# Altium schematic sheet 1_INDEX.SchDoc
size 420 x 297 mm; SheetNumber: 1; SheetTotal: 7; Project: SATELLITE-4U-LASER-INT-EXT
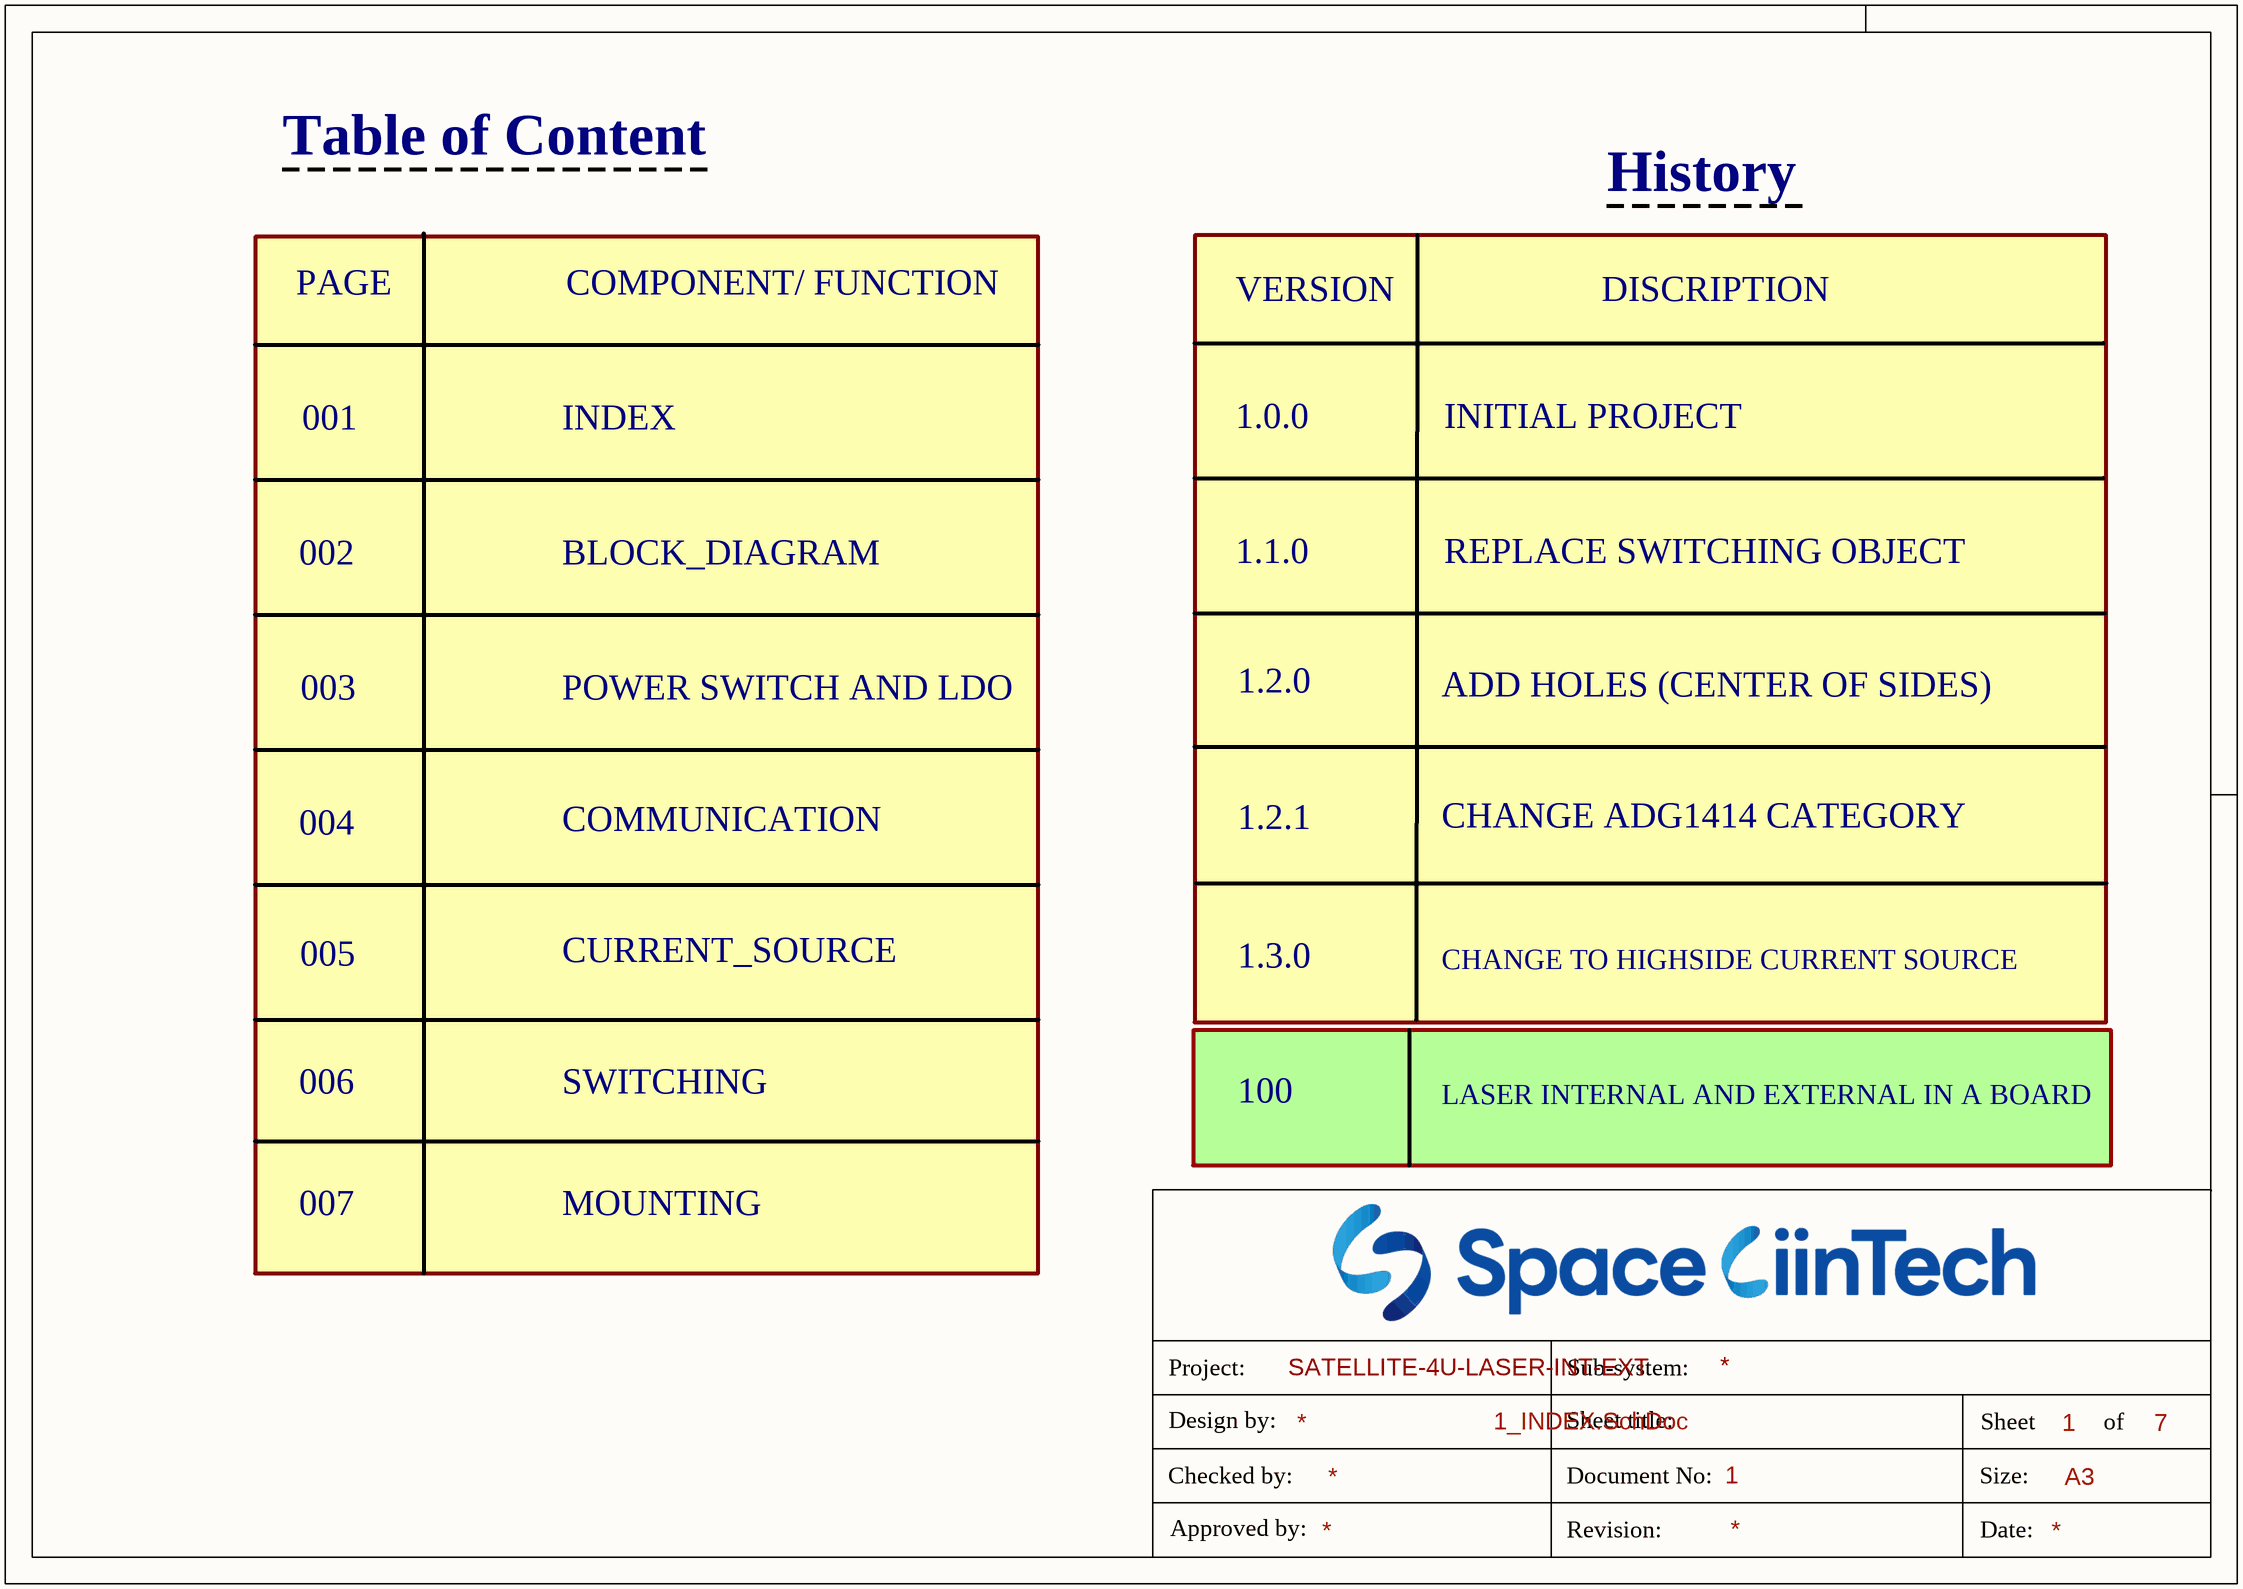
[diagram p0: 1_INDEX.SchDoc]

## Notes on the sheet
- Table of Content
- History
- PAGE
- COMPONENT/ FUNCTION
- VERSION
- DISCRIPTION
- 001
- INDEX
- 1.0.0
- INITIAL PROJECT
- 002
- BLOCK_DIAGRAM
- 1.1.0
- REPLACE SWITCHING OBJECT
- 003
- POWER SWITCH AND LDO
- 1.2.0
- ADD HOLES (CENTER OF SIDES)
- 004
- COMMUNICATION
- 1.2.1
- CHANGE ADG1414 CATEGORY
- 005
- CURRENT_SOURCE
- 1.3.0
- CHANGE TO HIGHSIDE CURRENT SOURCE
- 006
- SWITCHING
- 100
- LASER INTERNAL AND EXTERNAL IN A BOARD
- 007
- MOUNTING
- Project:
- Sub-system:
- Design by:
- Sheet title:
- Sheet
- A3
- of
- Checked by:
- Approved by:
- Revision:
- Document No:
- Size:
- Date: